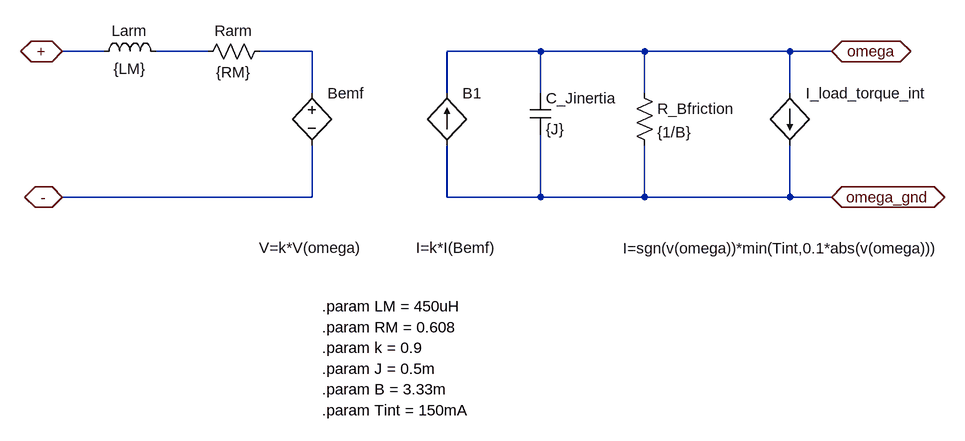
[diagram p0: schematic DC_Motor.asc]
DC_Motor.asc, the LTspice schematic file:
Version 4
SHEET 1 1828 680
WIRE 0 -256 -64 -256
WIRE 160 -256 80 -256
WIRE 320 -256 240 -256
WIRE 672 -256 528 -256
WIRE 832 -256 672 -256
WIRE 1056 -256 832 -256
WIRE 1120 -256 1056 -256
WIRE 320 -192 320 -256
WIRE 528 -192 528 -256
WIRE 672 -192 672 -256
WIRE 832 -192 832 -256
WIRE 1056 -192 1056 -256
WIRE 320 -32 320 -112
WIRE 320 -32 -64 -32
WIRE 528 -32 528 -112
WIRE 672 -32 672 -128
WIRE 672 -32 528 -32
WIRE 832 -32 832 -112
WIRE 832 -32 672 -32
WIRE 1056 -32 1056 -112
WIRE 1056 -32 832 -32
WIRE 1120 -32 1056 -32
FLAG -64 -256 +
IOPIN -64 -256 BiDir
FLAG -64 -32 -
IOPIN -64 -32 BiDir
FLAG 1120 -256 omega
IOPIN 1120 -256 BiDir
FLAG 1120 -32 omega_gnd
IOPIN 1120 -32 BiDir
SYMBOL ind -16 -240 R270
WINDOW 0 32 56 VTop 2
WINDOW 3 5 56 VBottom 2
SYMATTR InstName Larm
SYMATTR Value {LM}
SYMBOL res 256 -272 R90
WINDOW 0 0 56 VBottom 2
WINDOW 3 32 56 VTop 2
SYMATTR InstName Rarm
SYMATTR Value {RM}
SYMBOL bi2 528 -192 R0
WINDOW 3 -48 238 Left 2
SYMATTR Value I=k*I(Bemf)
SYMATTR InstName B1
SYMBOL cap 656 -192 R0
SYMATTR InstName C_Jinertia
SYMATTR Value {J}
SYMBOL res 816 -208 R0
SYMATTR InstName R_Bfriction
SYMATTR Value {1/B}
SYMBOL bi 1056 -192 R0
WINDOW 3 -257 239 Left 2
SYMATTR Value I=sgn(v(omega))*min(Tint,0.1*abs(v(omega)))
SYMATTR InstName I_load_torque_int
SYMBOL bv 320 -208 R0
WINDOW 3 -81 254 Left 2
SYMATTR Value V=k*V(omega)
SYMATTR InstName Bemf
TEXT 336 168 Left 2 !.param RM = 0.608
TEXT 336 200 Left 2 !.param k = 0.9
TEXT 336 232 Left 2 !.param J = 0.5m
TEXT 336 264 Left 2 !.param B = 3.33m
TEXT 336 296 Left 2 !.param Tint = 150mA
TEXT 336 136 Left 2 !.param LM = 450uH

The netlist it stands for:
* DC_Motor.asc
Larm + N001 {LM}
Rarm N002 N001 {RM}
B1 omega_gnd omega I=k*I(Bemf)
C_Jinertia omega omega_gnd {J}
R_Bfriction omega omega_gnd {1/B}
B§I_load_torque_int omega omega_gnd I=sgn(v(omega))*min(Tint,0.1*abs(v(omega)))
Bemf N002 - V=k*V(omega)
.param RM = 0.608
.param k = 0.9
.param J = 0.5m
.param B = 3.33m
.param Tint = 150mA
.param LM = 450uH
.backanno
.end